# Altium schematic sheet TFD-50RA.SchDoc
size A3; Address1: Address1; Address2: Address2; Address3: Address3; Address4: Address4; DocumentNumber: АБВГ.123456.001 Э3; SheetNumber: 1; Scale: 1:1; DocumentType: Схема электрическая принципиальная; FirstReferrence: АБВГ.123456.001
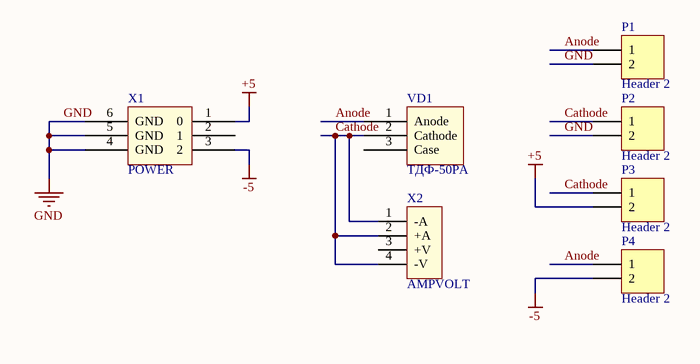
[diagram p0: TFD-50RA.SchDoc]

## Parts
P1  Header 2  [HDR1X2]
P2  Header 2  [HDR1X2]
P3  Header 2  [HDR1X2]
P4  Header 2  [HDR1X2]
VD1  ТДФ-50РА  [ТДФ-50РА]
X1  POWER  [POWER]
X2  AMPVOLT  [AMP_VOLTMETER]

## Nets
+5: P3.2 X1.1(0)
-5: P4.2 X1.3(2)
GND: P1.2 P2.2 X1.4(GND) X1.5(GND) X1.6(GND)
Anode: P1.1 P4.1 VD1.1(Anode)
Cathode: P2.1 P3.1 VD1.2(Cathode) X2.1(-A) X2.2(+A) X2.4(-V)

Not connected (* = marked no-connect by the designer): VD1 3(Case); X1 2(1); X2 3(+V)

## Notes on the sheet
- Title
- Size:
- Date:
- A3
- Number:
- Time:
- Revision:
- Sheet
- of
- File:

## Library data of the parts
P1-P4 = Header 2: Header, 2-Pin; LatestRevisionDate: 17-Jul-2002; LatestRevisionNote: Re-released for DXP Platform.; Publisher: Altium Limited
X2 = AMP_VOLTMETER